# EAGLE design vga_edid_injector (EAGLE 5.11)
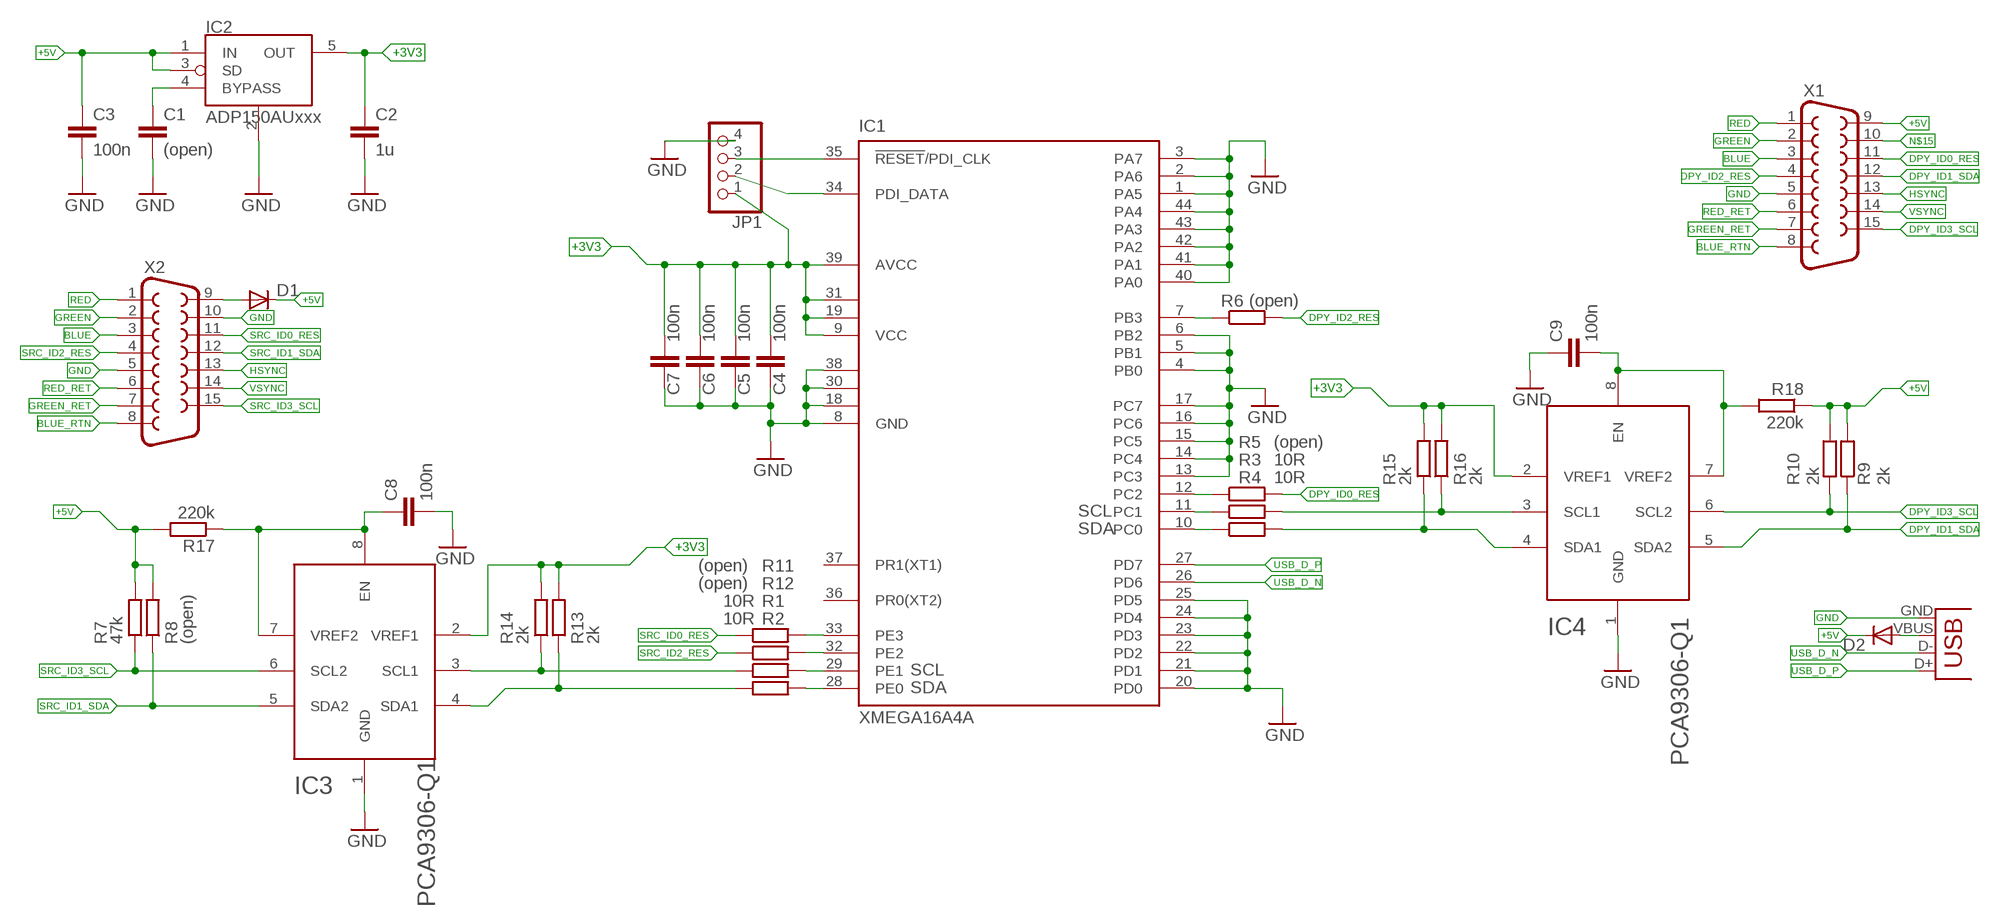
[diagram p0: schematic, sheet 1]

## Parts
C1  (open)  C-EUC0603  [C0603]
C2  1u  C-EUC0603  [C0603]
C3  100n  C-EUC0603  [C0603]
C4  100n  C-EUC0603  [C0603]
C5  100n  C-EUC0603  [C0603]
C6  100n  C-EUC0603  [C0603]
C7  100n  C-EUC0603  [C0603]
C8  100n  C-EUC0603  [C0603]
C9  100n  C-EUC0603  [C0603]
D1  DIODE-MINIMELF  [MINIMELF]
D2  DIODE-MINIMELF  [MINIMELF]
IC1  XMEGA16A4A  [TQFP44]
IC2  ADP150AUxxx  LP2985M5  [SOT23-5L]
IC3  PCA9306-Q1  [R-PDSO-G8]
IC4  PCA9306-Q1  [R-PDSO-G8]
JP1  PINHD-1X4/90  [1X04/90]
R1  10R  R-EU_R0603  [R0603]
R2  10R  R-EU_R0603  [R0603]
R3  10R  R-EU_R0603  [R0603]
R4  10R  R-EU_R0603  [R0603]
R5  (open)  R-EU_R0603  [R0603]
R6  (open)  R-EU_R0603  [R0603]
R7  47k  R-EU_R0603  [R0603]
R8  (open)  R-EU_R0603  [R0603]
R9  2k  R-EU_R0603  [R0603]
R10  2k  R-EU_R0603  [R0603]
R11  (open)  R-EU_R0603  [R0603]
R12  (open)  R-EU_R0603  [R0603]
R13  2k  R-EU_R0603  [R0603]
R14  2k  R-EU_R0603  [R0603]
R15  2k  R-EU_R0603  [R0603]
R16  2k  R-EU_R0603  [R0603]
R17  220k  R-EU_R0603  [R0603]
R18  220k  R-EU_R0603  [R0603]
X1  F15HDH  [HDF15H]
X2  F15HDH  [HDF15H]
X4  USB-MICROB  [USB-MICROB]

## Nets
+3V3: C2.1 C4.1 C5.1 C6.1 C7.1 IC1.9(VCC) IC1.19(VCC1) IC1.31(VCC2) IC1.39(AVCC) IC2.5(OUT) IC3.2(VREF1) IC4.2(VREF1) JP1.1 R13.2 R14.2 R15.2 R16.2
+5V: C3.1 D1.C D2.C IC2.1(IN) IC2.3(SD) R7.2 R8.2 R9.2 R10.2 R17.2 R18.1 X1.9
BLUE: X1.3 X2.3
BLUE_RTN: X1.8 X2.8
DPY_ID0_C: IC1.12(PC2) R5.1
DPY_ID0_RES: R5.2 X1.11
DPY_ID1_SDA: IC4.5(SDA2) R9.1 X1.12
DPY_ID1_SDA_C: IC1.10(PC0) R4.1
DPY_ID1_SDA_R: IC4.4(SDA1) R4.2 R15.1
DPY_ID2_C: IC1.7(PB3) R6.1
DPY_ID2_RES: R6.2 X1.4
DPY_ID3_SCL: IC4.6(SCL2) R10.1 X1.15
DPY_ID3_SCL_C: IC1.11(PC1) R3.1
DPY_ID3_SCL_R: IC4.3(SCL1) R3.2 R16.1
GND: C1.2 C2.2 C3.2 C4.2 C5.2 C6.2 C7.2 C8.2 C9.1 IC1.1(PA5) IC1.2(PA6) IC1.3(PA7) IC1.4(PB0) IC1.5(PB1) IC1.6(PB2) IC1.8(GND) IC1.13(PC3) IC1.14(PC4) IC1.15(PC5) IC1.16(PC6) IC1.17(PC7) IC1.18(GND1) IC1.20(PD0) IC1.21(PD1) IC1.22(PD2) IC1.23(PD3) IC1.24(PD4) IC1.25(PD5) IC1.30(GND2) IC1.38(GND3) IC1.40(PA0) IC1.41(PA1) IC1.42(PA2) IC1.43(PA3) IC1.44(PA4) IC2.2(GND) IC3.1(GND) IC4.1(GND) JP1.4 X1.5 X2.5 X2.10 X4.GND
GREEN: X1.2 X2.2
GREEN_RET: X1.7 X2.7
HSYNC: X1.13 X2.13
N$9: C1.1 IC2.4(BYPASS)
N$10: C9.2 IC4.7(VREF2) IC4.8(EN) R18.2
N$11: D1.A X2.9
N$12: IC1.35(!RESET!/PDI_CLK) JP1.3
N$13: IC1.34(PDI_DATA) JP1.2
N$14: D2.A X4.VBUS
N$15: X1.10
N$20: C8.1 IC3.7(VREF2) IC3.8(EN) R17.1
RED: X1.1 X2.1
RED_RET: X1.6 X2.6
SRC_ID0_C: IC1.33(PE3) R11.2
SRC_ID0_RES: R11.1 X2.11
SRC_ID1_SDA: IC3.5(SDA2) R8.1 X2.12
SRC_ID1_SDA_C: IC1.28(PE0) R2.2
SRC_ID1_SDA_R: IC3.4(SDA1) R2.1 R13.1
SRC_ID2_C: IC1.32(PE2) R12.2
SRC_ID2_RES: R12.1 X2.4
SRC_ID3_SCL: IC3.6(SCL2) R7.1 X2.15
SRC_ID3_SCL_C: IC1.29(PE1) R1.2
SRC_ID3_SCL_R: IC3.3(SCL1) R1.1 R14.1
USB_D_N: IC1.26(PD6) X4.D-
USB_D_P: IC1.27(PD7) X4.D+
VSYNC: X1.14 X2.14
Unconnected: IC1.36(PR0(XT2)) IC1.37(PR1(XT1))

## Notes on the sheet
- SCL
- SDA
- SCL
- SDA

## Library data of the parts
C1-C9 = rcl:C-EU: CAPACITOR, European symbol
D1 D2 = diode:DIODE-: DIODE
IC1 = atmel:XMEGA16A4: MICROCONTROLLER Features High-performance, Low-power 8/16-bit AVR XMEGA Microcontroller Non-Volatile Program and Data Memories - 16 KB - 128 KB of In-System Self-Programmable Flash - 4 KB - 8 KB Boot Code Section with Independent Lock Bits - 1 KB - 2 KB EEPROM - 2 KB - 8 KB Internal SRAM Peripheral Features - Four-channel DMA Controller with support for external requests - Eight-channel Event System - Five 16-bit Timer/Counters Three Timer/Counters with 4 Output Compare or Input Capture channels Two Timer/Counters with 2 Output Compare or Input Capture channels High-Resolution Extensions on all Timer/Counters Advanced Waveform Extension on one Timer/Counter - Five USARTs IrDA Extension on one USART - Two Two-Wire Interfaces with dual address match (I2C and SMBus compatible) - Two SPIs (Serial Peripheral Interfaces) peripherals - AES and DES Crypto Engine - 16-bit Real Time Counter with Separate Oscillator - One Twelve-channel, 12-bit, 2 Msps Analog to Digital Converter - One Two-channel, 12-bit, 1 Msps Digital to Analog Converter - Two Analog Comparators with Window compare function - External Interrupts on all General Purpose I/O pins - Programmable Watchdog Timer with Separate On-chip Ultra Low Power Oscillator Special Microcontroller Features - Power-on Reset and Programmable Brown-out Detection - Internal and External Clock Options with PLL - Programmable Multi-level Interrupt Controller - Sleep Modes: Idle, Power-down, Standby, Power-save, Extended Standby - Advanced Programming, Test and Debugging Interfaces PDI (Program and Debug Interface) for programming, test and debugging I/O and Packages - 34 Programmable I/O Lines - 44 - lead TQFP - 44 - pad VQFN/QFN - 49 - ball VFBGA Operating Voltage - 1.6 - 3.6V Speed performance - 0 - 12 MHz @ 1.6 - 3.6V - 0 - 32 MHz @ 2.7 - 3.6V Drawn by Dipl.-Ing. (FH) Robert Siegler Created: 27.05.09; OC_FARNELL: unknown; OC_NEWARK: unknown
IC2 = WW-Power:LP2985: Micropower 150 mA Low-Noise Ultra Low-Dropout Regulator in SOT-23 and micro SMD Packages Designed for Use with Very Low ESR Output Capacitors Dropout: 300 mV @ 150 mA Input voltage up to 16V (absolute max.) For noise reduction, add 10nF ceramic at bypass pin. Pin compatible with: ADP150 (lower noise) ADP151 (200mA, even lower noise)
IC3 IC4 = edid_IC:PCA9306-Q1
JP1 = pinhead:PINHD-1X4: PIN HEADER
R1-R18 = rcl:R-EU_: RESISTOR, European symbol
X1 X2 = con-subd:F15: SUB-D
X4 = SparkFun:USB: USB Connectors USB-B-PTH is fully proven SKU : PRT-00139 USB-miniB is fully proven SKU : PRT-00587 USB-A-PCB is untested. USB-A-H is throughly reviewed, but untested. Spark Fun Electronics SKU : PRT-00437 USB-B-SMT is throughly reviewed, but untested. Needs silkscreen touching up. USB-A-S has not been used/tested USB-MB-H has not been used/tested

## Board
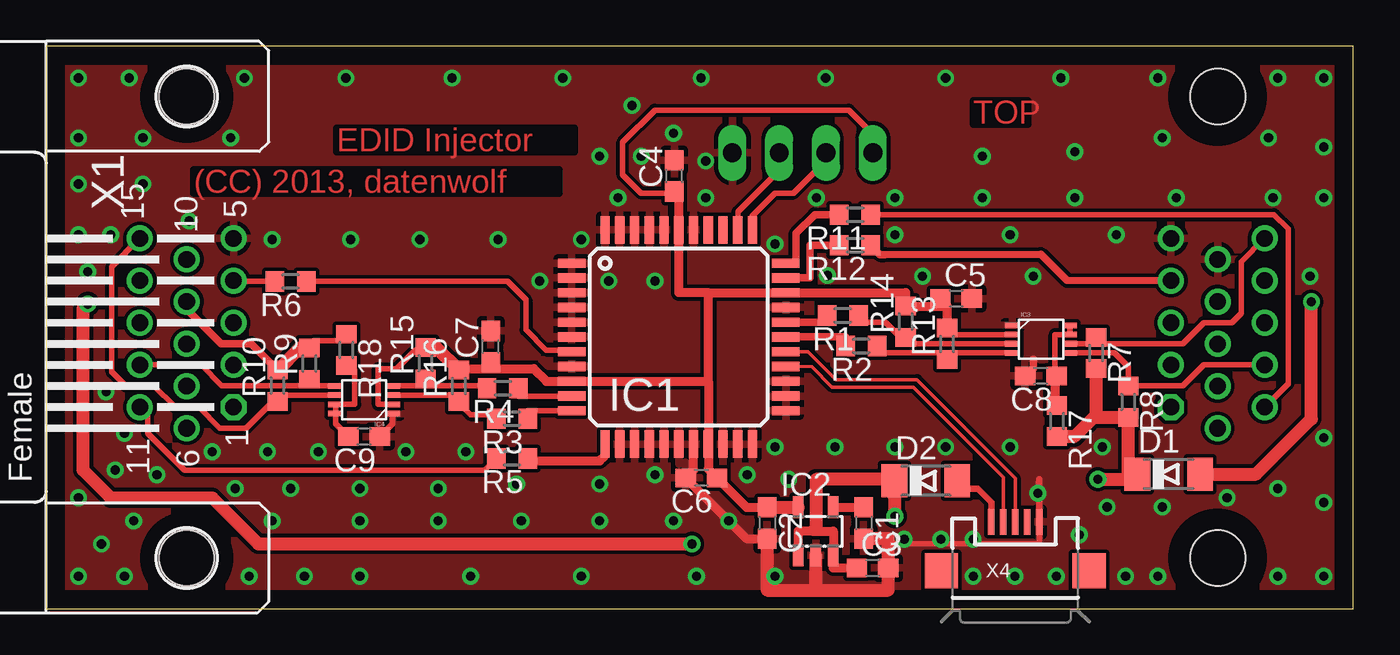
[diagram p1: board, top side]
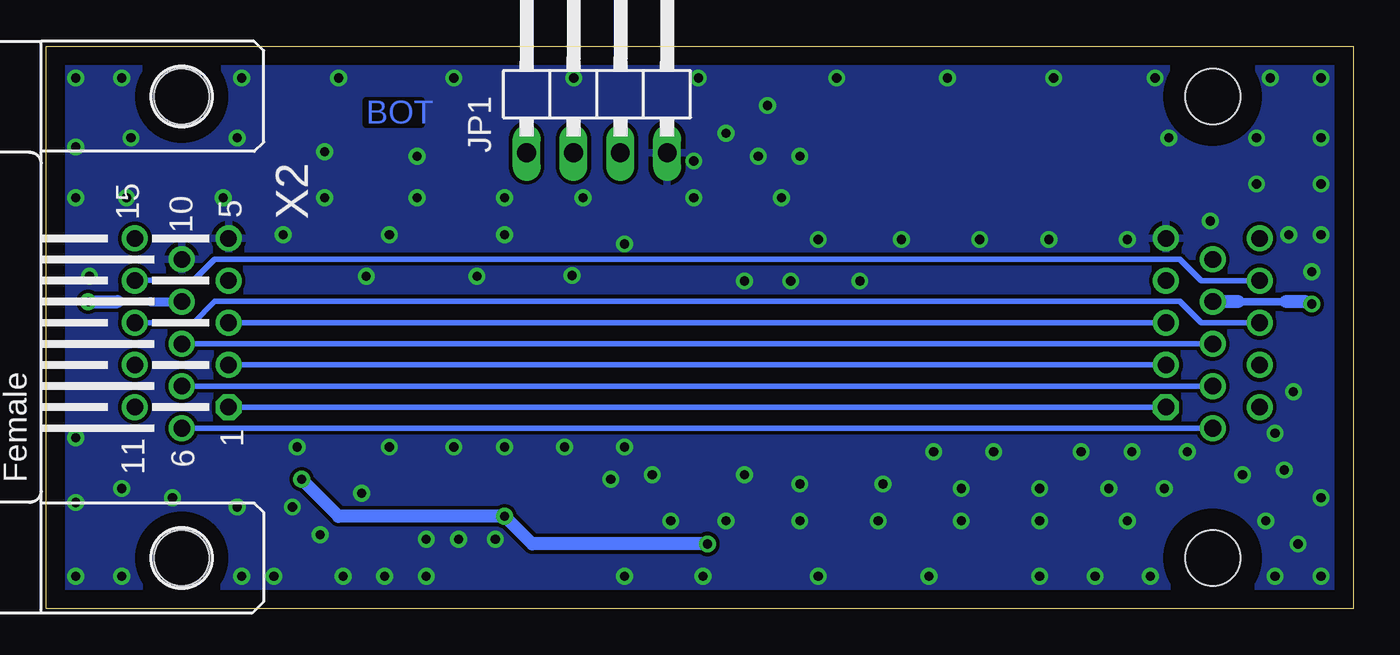
[diagram p2: board, bottom side, seen from below]

Size 70.85 x 30.47 mm. Coordinates in mm from the lower left corner, seen from the top.
Outline: 0,0 70.85,0 70.85,30.47 0,30.47 0,0
Copper layers (1*16): Top 0.035mm / dielectric 1.5mm / Bottom 0.035mm
Design rules "default": minimum track width 10mil, minimum drill 24mil, track to track 8mil, track to pad 8mil, pad to pad 8mil, via to via 8mil, smd to smd 8mil, copper to edge 40mil, drill to drill 8mil, minimum pad ring 10mil, minimum via ring 8mil, stop-mask expansion 4mil, vias tented up to drill 0mil, thermal gap 10mil

### Footprints (pad centres in the part's own frame; a part is rotated, then mirrored left to right if it is on the bottom)
C0603 = smd 1.1 x 1: 1 -0.85,0; 2 0.85,0
MINIMELF = smd 1.4 x 1.8: A 1.7,0; C -1.7,0
TQFP44 = smd 1.5 x 0.5: 1 -5.8,4; 2 -5.8,3.2; 3 -5.8,2.4; 4 -5.8,1.6; 5 -5.8,0.8; 6 -5.8,0; 7 -5.8,-0.8; 8 -5.8,-1.6; 9 -5.8,-2.4; 10 -5.8,-3.2; 11 -5.8,-4; 23 5.8,-4; 24 5.8,-3.2; 25 5.8,-2.4; 26 5.8,-1.6; 27 5.8,-0.8; 28 5.8,0; 29 5.8,0.8; 30 5.8,1.6; 31 5.8,2.4; 32 5.8,3.2; 33 5.8,4 | smd 0.5 x 1.5: 12 -4,-5.8; 13 -3.2,-5.8; 14 -2.4,-5.8; 15 -1.6,-5.8; 16 -0.8,-5.8; 17 0,-5.8; 18 0.8,-5.8; 19 1.6,-5.8; 20 2.4,-5.8; 21 3.2,-5.8; 22 4,-5.8; 34 4,5.8; 35 3.2,5.8; 36 2.4,5.8; 37 1.6,5.8; 38 0.8,5.8; 39 0,5.8; 40 -0.8,5.8; 41 -1.6,5.8; 42 -2.4,5.8; 43 -3.2,5.8; 44 -4,5.8
SOT23-5L = smd 0.55 x 1.2: 1 -0.95,-1.3; 2 0,-1.3; 3 0.95,-1.3; 4 0.95,1.3; 5 -0.95,1.3
R-PDSO-G8 = smd 0.8 x 0.3: 1 -1.55,0.75; 2 -1.55,0.25; 3 -1.55,-0.25; 4 -1.55,-0.75; 5 1.55,-0.75; 6 1.55,-0.25; 7 1.55,0.25; 8 1.55,0.75
1X04/90 = drill 1.016 long: 1 -3.81,-3.81; 2 -1.27,-3.81; 3 1.27,-3.81; 4 3.81,-3.81
R0603 = smd 1 x 1.1: 1 -0.85,0; 2 0.85,0
HDF15H = drill 0.9 octagon: 1 4.329,2.54 | drill 0.9 round: 2 2.043,2.54; 3 -0.243,2.54; 4 -2.529,2.54; 5 -4.815,2.54; 6 5.472,0; 7 3.186,0; 8 0.9,0; 9 -1.386,0; 10 -3.672,0; 11 4.329,-2.54; 12 2.043,-2.54; 13 -0.243,-2.54; 14 -2.529,-2.54; 15 -4.815,-2.54 | hole 3: -12.5,0; 12.5,0
USB-MICROB = smd 0.35 x 1.4: D+ 0,2.65; D- -0.65,2.65; GND 1.3,2.65; ID 0.65,2.65; VBUS -1.3,2.65 | smd 1.8 x 1.9: MT1 -4,0; MT2 4,0

### Placement (x,y rotation side)
C1  44.31,4.63 270 top
C2  39.08,4.63 270 top
C3  44.79,2.2 0 top
C4  34.05,23.44 90 top
C5  49.31,16.8 0 top
C6  35.51,7.08 180 top
C7  24.09,14.19 90 top
C8  53.91,12.61 180 top
C9  17.23,9.31 180 top
D1  60.84,7.28 0 top
D2  47.68,6.92 0 top
IC1  34.29,14.71 0 top
IC2  41.71,4.18 0 top
IC3  53.92,14.6 0 top
IC4  17.24,11.31 180 top
JP1  41,28.5 0 bottom
R1  43.18,15.88 180 top
R2  44.18,14.22 180 top
R3  25.25,10.29 180 top
R4  24.75,11.94 180 top
R5  25.25,8.14 180 top
R6  13.25,17.72 180 top
R7  56.91,13.85 270 top
R8  58.65,11.2 270 top
R9  14.27,13.27 90 top
R10  12.54,12.07 90 top
R11  43.84,21.34 180 top
R12  43.84,19.68 180 top
R13  48.83,14.34 90 top
R14  46.59,15.54 90 top
R15  20.57,13.29 90 top
R16  22.37,12.06 90 top
R17  54.78,10.16 270 top
R18  16.27,14.01 270 top
X1  7.62,15.24 270 top
X2  63.5,15.24 270 bottom
X4  52.53,2.04 0 top

### Tracks (layer width: path | path; a pad name or v marks a point on that pad's centre or on a via)
+3V3
  Top 0.3: IC3.2 48.83,14.85 R13.2 | C5.1 48.5,16.8 48.5,16.39 | IC4.2 18,11.06 18,13 19,13 20,14 20.43,14 R15.2 | C7.1 24.09,13.09 24,13 | JP1.1 44.81,25.69 43.5,27 33,27 31.25,25.25 31.25,23.5 32.25,22.5 33.96,22.5 C4.1
  Top 0.5: C4.1 34.29,22.59 IC1.39 34.29,17.11 35.89,17.11 | C2.1 37.96,5.49 C6.1 35.89,7.55 IC1.19 35.89,12.31 | R13.2 48.83,16.39 48.5,16.39 R14.2 46.59,17.11 IC1.31 35.89,17.11 | R16.2 22.37,13 24,13 26.43,13 27.11,12.31 IC1.9 35.89,12.31 | 35.89,12.31 35.89,17.11
  Top 0.7: C2.1 IC2.5 | R15.2 21.14,14.14 R16.2
+5V  (via drill 0.5)
  Top 0.3: 41.73,4.4 41.5,4.4 41.5,4.2 | R18.1 16.09,14.5 14.5,14.5 14.5,14.12 R9.2
  Top 0.4: X1.9 7.62,16.2 9.47,14.35 11.12,14.35 R10.2
  Top 0.5: IC2.1 40.76,4.2 41.5,4.2 42.66,4.2 IC2.3 42.66,2.2 C3.1 | D1.C 58.65,7.28
  Top 0.7: 56.91,10.5 56.91,10.35 R8.2 58.65,7.28 | 56.91,10.5 R7.2 | v57,7 59.14,7 D1.C | D2.C v46,5 46,7 41.73,7 41.73,4.4 | R10.2 13.74,14.12 R9.2 | v2.25,16.5 2,16.25 2,15.75 2,7.5 3.5,6 9,6 11.5,3.5 v35,3.5 | R17.2 55.72,9.31 56.91,10.5
  Bottom 0.4: 3.65,16.62 6.25,16.62
  Bottom 0.7: v57,7 55,5 v46,5 44.5,3.5 v35,3.5 | X1.9 6.25,16.63 6.25,16.62 | 3.65,16.62 2.62,16.62 v2.25,16.5
BLUE
  Bottom 0.305: X1.3 X2.3
BLUE_RTN
  Bottom 0.305: X1.8 X2.8
DPY_ID0_C
  Top 0.5: IC1.12 30.29,8.29 30,8 26.23,8 R5.1
DPY_ID0_RES
  Top 0.3: R5.2 23.76,7.5 7.5,7.5 5.5,9.5 5.5,10.49 X1.11
DPY_ID1_SDA
  Top 0.3: 10.77,12.06 14.5,12.06 | 14.5,12.06 IC4.5 | R9.1 14.27,12.29 14.5,12.06
  Top 0.305: X1.12 8.39,13.2 9.53,12.06 10.77,12.06
DPY_ID1_SDA_C
  Top 0.305: IC1.10 25.6,11.51 R4.1
DPY_ID1_SDA_R
  Top 0.3: IC4.4 20.5,12.06 | 20.5,12.06 23.9,12.06 R4.2 | R15.1 20.57,12.13 20.5,12.06
DPY_ID2_C
  Top 0.3: R6.1 25,17.72 26,16.72 26,15.1 27.1,14 28.4,14 IC1.7
DPY_ID2_RES
  Top 0.3: X1.4 10.16,17.72 R6.2
DPY_ID3_SCL
  Top 0.3: IC4.6 12.64,11.56 12.54,11.46 | 11.36,10.29 12.54,11.46 | R10.1 12.54,11.46
  Top 0.305: X1.15 3.56,18.53 3.56,12.83 4.32,12.06 5.84,12.06 6.99,10.92 8.26,10.92 9.4,9.78 10.85,9.78 11.36,10.29
DPY_ID3_SCL_C
  Top 0.305: IC1.11 26.1,10.71 R3.1
DPY_ID3_SCL_R
  Top 0.3: IC4.3 21.93,11.56 22.5,11 23,10.5 24.18,10.5 R3.2
  Top 0.4: R16.1 22.37,11.13 22.5,11
GND  (via drill 0.5)
  Top 0.3: 45.64,3.79 45.64,3.5 53.83,3.5 X4.GND | IC4.1 18.79,10.02 C9.1
  Top 0.35: X4.GND 53.83,7 v53.75,6.25
  Top 0.4: 53.06,12.56 53.5,13 53.5,13.5 | C8.2 53.06,12.56 | 53.06,12.56 53,12.5
  Top 0.5: IC1.18 35.09,7.51 C6.2 37.96,3.79 C2.2
  Top 0.7: C1.2 45.64,3.79 C3.2 45.64,1 41.71,1 | C2.2 39.08,1 41.71,1 | 41.71,1 IC2.2
  other vias: 46,20.25 52.25,20.25 58,20.25 53.5,18 47.5,18 42.35,18.05 57.25,8.75 52.25,8.75 57.5,5.5 56,4 60.5,5.5 60.25,1.75 58.5,1.75 54.75,1.75 52.5,1.75 50.25,1.75 50.25,3.75 48.5,3.75 46.5,3.75 64,6 66.75,6.5 69.25,5.75 69.25,22.25 69.25,25 68.5,18 69.25,9.25 66.5,22.25 61.25,22.25 55.75,22.25 50.75,22.25 46,22.25 41.75,22.25 39.5,19.75 35.75,24.25 34,25.75 32.25,24.5 35.75,22.25 29,20 24.5,20 20.25,20 16.5,20 22.75,8.5 19.5,8.5 14.75,8.5 12,8.5 9,8.5 33,7.25 30,6.75 25.5,6.75 21.25,6.5 17,6.5 13.25,6.5 10.25,6.5 12.25,4.75 17,4.75 21.25,4.75 25.75,4.75 30,4.75 34,4.75 37,4.75 38,7.25 39.5,8.75 40.25,7 42.75,8.75 46,8.75 48.75,8.75 6,7.25 3.75,7.5 14,1.75 7.75,21 1.75,20.25 3.25,11.75 4.25,9.5 2.25,18.25 3.5,20.25 1.75,23 1.75,6 1.75,1.75 4.75,4.75 4.25,1.75 3,3.5 11,1.75 17,1.75 23,1.75 29,1.75 35.25,1.75 39.5,1.75 1.75,25.5 1.75,28.75 4.5,28.75 5.25,25.5 10,25.5 10.75,28.75 16.25,28.75 22,28.75 28,28.75 35.5,28.75 42.25,28.75 48.75,28.75 55,28.75 60.25,28.75 60.5,25.5 66.25,25.5 66.75,28.75 69.25,28.75 69.25,1.75 66.75,1.75 5.25,23 12.25,20 50.75,24.5 30.5,17.75 33,17.75 26.75,17.75 31.75,27.25 30,24.5 31,22.25 55.75,24.75
  pour Bottom: 0,0 70.8,0 70.8,30.48 0,30.48
  pour Top: 0,0 70.8,0 70.8,30.48 0,30.48
GREEN
  Bottom 0.305: X1.2 X2.2
GREEN_RET
  Bottom 0.305: X1.7 X2.7
HSYNC
  Bottom 0.305: X1.13 8.24,15.48 9.4,16.64 61.72,16.64 62.87,15.49 66.03,15.49 X2.13
N$9
  Top 0.5: IC2.4 C1.1
N$10
  Top 0.3: C9.2 15.69,10.01 IC4.8 IC4.7 16.73,11.06 16.73,12.93 R18.2
N$11  (via drill 0.5)
  Top 0.7: v68.58,16.62 68.58,10.28 65.58,7.28 D1.A
  Bottom 0.406: 66.97,16.62 65.2,16.62
  Bottom 0.5: X2.9 65.2,16.62
  Bottom 0.7: v68.58,16.62 66.97,16.62
N$12
  Top 0.3: IC1.35 37.49,21.49 39.73,23.73 JP1.3
N$13
  Top 0.3: IC1.34 38.25,20.55 38.25,21.25 39.5,22.5 40.5,22.5 42.27,24.27 JP1.2
N$14
  Top 0.35: X4.VBUS 51.23,5.77 50.5,6.5 49.8,6.5 D2.A
N$20
  Top 0.3: IC3.8 IC3.7 54.68,14.85 54.68,12.61 C8.1
  Top 0.5: 54.68,12.61 54.68,11.01 R17.1
RED
  Bottom 0.305: X1.1 X2.1
RED_RET
  Bottom 0.305: X1.6 X2.6
SRC_ID0_C
  Top 0.406: IC1.33 40.64,18.71 40.64,20.32 41.66,21.34 R11.2
SRC_ID0_RES
  Top 0.305: X2.11 67.31,12.18 67.31,20.57 66.55,21.34 R11.1
SRC_ID1_SDA
  Top 0.3: IC3.5 56.9,13.85 57.9,13.85 58.65,13.1 R8.1
  Top 0.305: 58.63,12.13 58.7,12.06 61.59,12.06 62.74,13.21 66.03,13.21 X2.12
  Top 0.5: R8.1 58.65,12.13 58.63,12.13
SRC_ID1_SDA_C
  Top 0.406: IC1.28 43.33,14.71 R2.2
SRC_ID1_SDA_R
  Top 0.25: 49,13.85 R13.1
  Top 0.3: IC3.4 49,13.85 45.03,13.85 R2.1
SRC_ID2_C
  Top 0.406: IC1.32 41.4,17.91 41.4,19.68 R12.2
SRC_ID2_RES
  Top 0.406: R12.1 45.2,19.18 45.45,19.18 53.91,19.18 55.33,17.78 60.59,17.77 X2.4
SRC_ID3_SCL
  Top 0.3: IC3.6 56.64,14.35 R7.1 57.14,14.35 61.59,14.35
  Top 0.305: 61.59,14.35 62.74,15.49 64.26,15.49 64.77,16 64.77,18.8 66.03,20.05 X2.15
SRC_ID3_SCL_C
  Top 0.406: IC1.29 42.33,15.51 R1.2
SRC_ID3_SCL_R
  Top 0.25: R14.1 46.65,14.35
  Top 0.3: IC3.3 46.65,14.35 45.5,15.5 44.03,15.5 R1.1
USB_D_N
  Top 0.2: IC1.26 41.5,13.1 42.6,12 47,12 51.88,7.12 X4.D-
USB_D_P
  Top 0.2: IC1.27 41.3,13.9 42.8,12.4 47.2,12.4 52.53,7.07 X4.D+
VSYNC
  Bottom 0.305: X1.14 8.24,17.77 9.4,18.92 61.72,18.92 62.87,17.78 66.03,17.78 X2.14

### Text on the board
Top: TOP | EDID Injector | (CC) 2013, datenwolf
Bottom: BOT
tStop: EDID Injector | (CC) 2013, datenwolf
Document: MALE!